# Altium schematic sheet [2]_ARM.SchDoc
size B
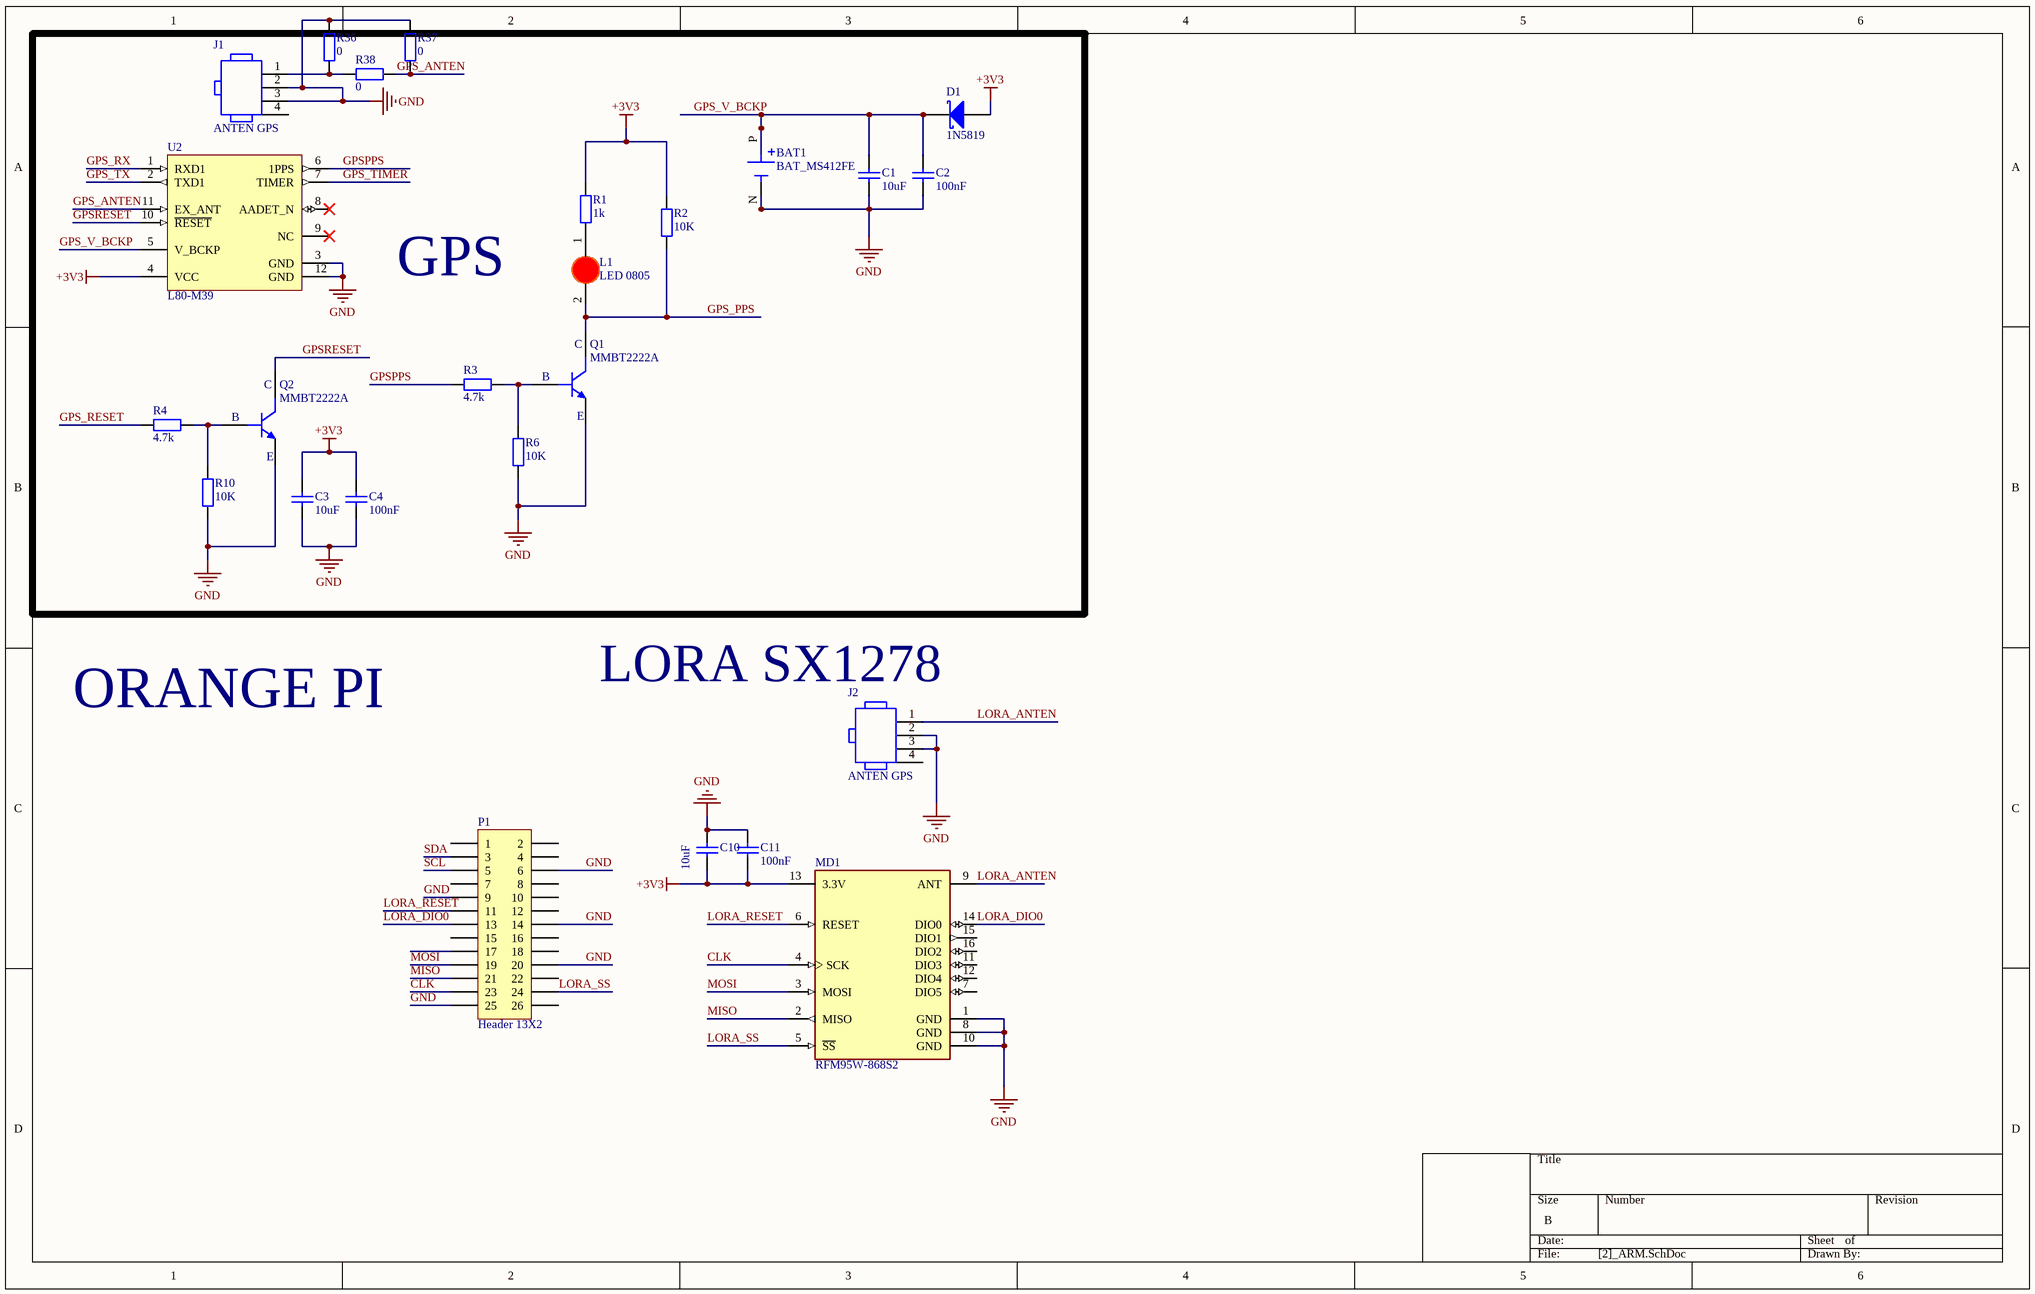
[diagram p0: [2]_ARM.SchDoc]

## Parts
BAT1  BAT_MS412FE  [MS412FE]
C1  10uF  [tu 0603]
C2  100nF  [tu 0603]
C3  10uF  [tu 0603]
C4  100nF  [tu 0603]
C10  10uF  [tu 0603]
C11  100nF  [tu 0603]
D1  1N5819  [DO-214AA]
J1  ANTEN GPS  [TG-RECE-20369-001E-4_V]
J2  ANTEN GPS  [TG-RECE-20369-001E-4_V]
L1  LED 0805  [LED-0805-Red]
MD1  RFM95W-868S2  [FP-RFM95W-868S2-MFG]
P1  Header 13X2  [HDR2X13]
Q1  MMBT2222A  [SOT_23_3]
Q2  MMBT2222A  [SOT_23_3]
R1  1k  [tro smd 0603]
R2  10K  [tro smd 0603]
R3  4.7k  [tro smd 0603]
R4  4.7k  [tro smd 0603]
R6  10K  [tro smd 0603]
R10  10K  [tro smd 0603]
R36  0  [tro smd 0603]
R37  0  [tro smd 0603]
R38  0  [tro smd 0603]
U2  L80-M39  [QUEC-L80-M39-12_V]

## Blocks framed on the sheet
GPS: BAT1 C1-C4 D1 J1 L1 Q1 Q2 R1-R4 R6 R10 R36-R38 U2

## Nets
+3V3: C3.2 C4.1 C10.2 C11.2 D1.1(A) MD1.13(3.3V) R1.2 R2.2 U2.4(VCC)
GND: BAT1.N(NEG) C1.1 C2.2 C3.1 C4.2 C10.1 C11.1 J1.2 J1.3 J2.2 J2.3 MD1.1(GND) MD1.8(GND) MD1.10(GND) P1.6 P1.9 P1.14 P1.20 P1.25 Q1.2(E) Q2.2(E) R6.1 R10.1 R36.2 R37.2 U2.3(GND) U2.12(GND)
CLK: MD1.4(SCK) P1.23
GPS_ANTEN: R37.1 R38.1 U2.11(EX_ANT)
GPS_PPS: L1.2(K) Q1.3(C) R2.1
GPS_RESET: R4.1
GPS_RX: U2.1(RXD1)
GPS_TIMER: U2.7(TIMER)
GPS_TX: U2.2(TXD1)
GPS_V_BCKP: BAT1.P(POS) C1.2 C2.1 D1.2(K) U2.5(V_BCKP)
GPSPPS: R3.1 U2.6(1PPS)
GPSRESET: Q2.3(C) U2.10(~{RESET})
LORA_ANTEN: J2.1 MD1.9(ANT)
LORA_DIO0: MD1.14(DIO0) P1.13
LORA_RESET: MD1.6(RESET) P1.11
LORA_SS: MD1.5(~{SS}) P1.24
MISO: MD1.2(MISO) P1.21
MOSI: MD1.3(MOSI) P1.19
SCL: P1.5
SDA: P1.3
NetJ1_1: J1.1 R36.1 R38.2
NetL1_1: L1.1(A) R1.1
NetQ1_1: Q1.1(B) R3.2 R6.2
NetQ2_1: Q2.1(B) R4.2 R10.2

Not connected (* = marked no-connect by the designer): J1 4; J2 4; MD1 7(DIO5) 11(DIO3) 12(DIO4) 15(DIO1) 16(DIO2); P1 1 2 4 7 8 10 12 15 16 17 18 22 26; U2 8(AADET_N)* 9(NC)*

## Notes on the sheet
- (near J2) LORA SX1278
- ORANGE PI

## Library data of the parts
C1 C3 C10 = Tu 0603 105 16V 20%: Dán; Don_Vi: Con; So_Chan: 2; Ten_Linh_Kien: Tụ 0603 105-1uF 20% 16V; Ma_Hang: MH004574; Chung_Loai: Dán; Kieu_Chan: *
C2 C4 C11 = Tu 0603 104 50V 10%: Dán; Don_Vi: Con; So_Chan: 2; Ten_Linh_Kien: Tụ 0603 104-100nF 10% 50V; Ma_Hang: MH004568; Chung_Loai: Dán; Kieu_Chan: *
D1 = DIO_SS14: DIODE SCHOTTKY 1A 40V SMA DO-214AA; Manufacturer: Fairchild; Part number: SS14; Cost: 600; Package: DO-214AA; ComponentLink1Description: Link product; ComponentLink1URL: https://www.thegioiic.com/ss14-sma-diode-schottky-1a-1n5819
J1 J2 = CMP-0275-00001-2: RF Connector, Onboard Receptacle, IPEX MHFIII; Manufacturer: Taoglas; PartNumber: RECE-20369-001E-01; Packing: Tape and Reel; Mounting Technology: Surface Mount; PackageReference: RECE-20369-001E-01-4; ComponentLink1URL: http://www.taoglas.com/; Housing Color: Gold; DatasheetVersion: Rev. C; ComponentLink2URL: http://www.taoglas.com/images/product_images/original_images/RECE.20369.001E.01.pdf; ComponentLink3Description: Package Specification; PackageVersion: Rev. C; ComponentLink1Description: Manufacturer URL; ComponentLink2Description: Datasheet; PackageDescription: 4-Pin, Hand Drawn, Body 1.7x1.7mm; ComponentLink3URL: http://www.taoglas.com/images/product_images/original_images/RECE.20369.001E.01.pdf
L1 = LED 0805 Do: Dán; Don_Vi: Con; Ma_Hang: MH000897; Ten_Linh_Kien: LED 0805 Màu Đỏ (Red); Ghi_Chu: *; Kieu_Chan: *; Chung_Loai: Dán
MD1 = CMP-204316-000001-1: RX TXRX MODULE ISM < 1GHZ SMD; Data Rate: 300Kbps; Frequency: 868MHz; Sensitivity: -123dBm; Interface: SPI; Current - Transmitting: 120mA; Current - Receiving: 12.1mA; Max Operating Temperature: 70°C; Case/Package: SMD/SMT; Packaging: Bulk; Mount: Surface Mount; Min Operating Temperature: -20°C
P1 = Header 13X2: Header, 13-Pin, Dual row; LatestRevisionDate: 17-Jul-2002; LatestRevisionNote: Re-released for DXP Platform.; Publisher: Altium Limited
Q1 Q2 = BJT_NPN_MMBT2222A: MMBT2222A NPN 40V 0.6A; Manufacturer: OEM; Cost: 500; Part number: MMBT2222A; ComponentLink1Description: Link product; ComponentLink1URL: https://www.thegioiic.com/mmbt2222a-transistor-npn-40v-0-6a-3-chan-sot-23; Package: SOT-23
R1-R4 R6 R10 R36-R38 = Tro 0603 1% 4.3 k: Dán; Don_Vi: Con; So_Chan: 2; Ten_Linh_Kien: Trở 0603 1% 4.3k; Ma_Hang: MH008715; Chung_Loai: Dán; Kieu_Chan: *
U2 = CMP-2000-05325-1: GPS Module L80 Hardware Design, 1575.42 MHz, 3 to 4.3 V, -40 to 85 degC, 12-Pin SMD, RoHS, Tape and Reel; Manufacturer: Quectel; Maximum Operating Supply Voltage: 4.3V; Screening Level: ExtendedIndustrial; Typical Operating Supply Voltage: 3.3V; Minimum Operating Supply Voltage: 3V; Manufacturer URL: http://www.quectel.com/; Mounting: SurfaceMount; Maximum Operating Frequency: 1575.42MHz; Datasheet Version: Rev. V1.1, 08/2013; Datasheet URL: http://www.quectel.com/uploadimage/downlad/l80_hardware_design_v1.1.pdf